# Altium schematic sheet Programador XILINX.SCHDOC
size 276 x 175 mm; SheetNumber: 0; SheetTotal: 0; REV 1: AAAAAAAAAAAAAAAA AAAAAAAAAAAAAAA AAAAAAAAAAAAAAAAAA AAAAAAAAAAAAAAAAAAA AAAAAAAAAAAAAAAAAAAAA AAAAAAAAAAAAAAAAAAAAA AAAAAAAAAAAAAAAAAAAAAA AAAAAAAAAAAAA
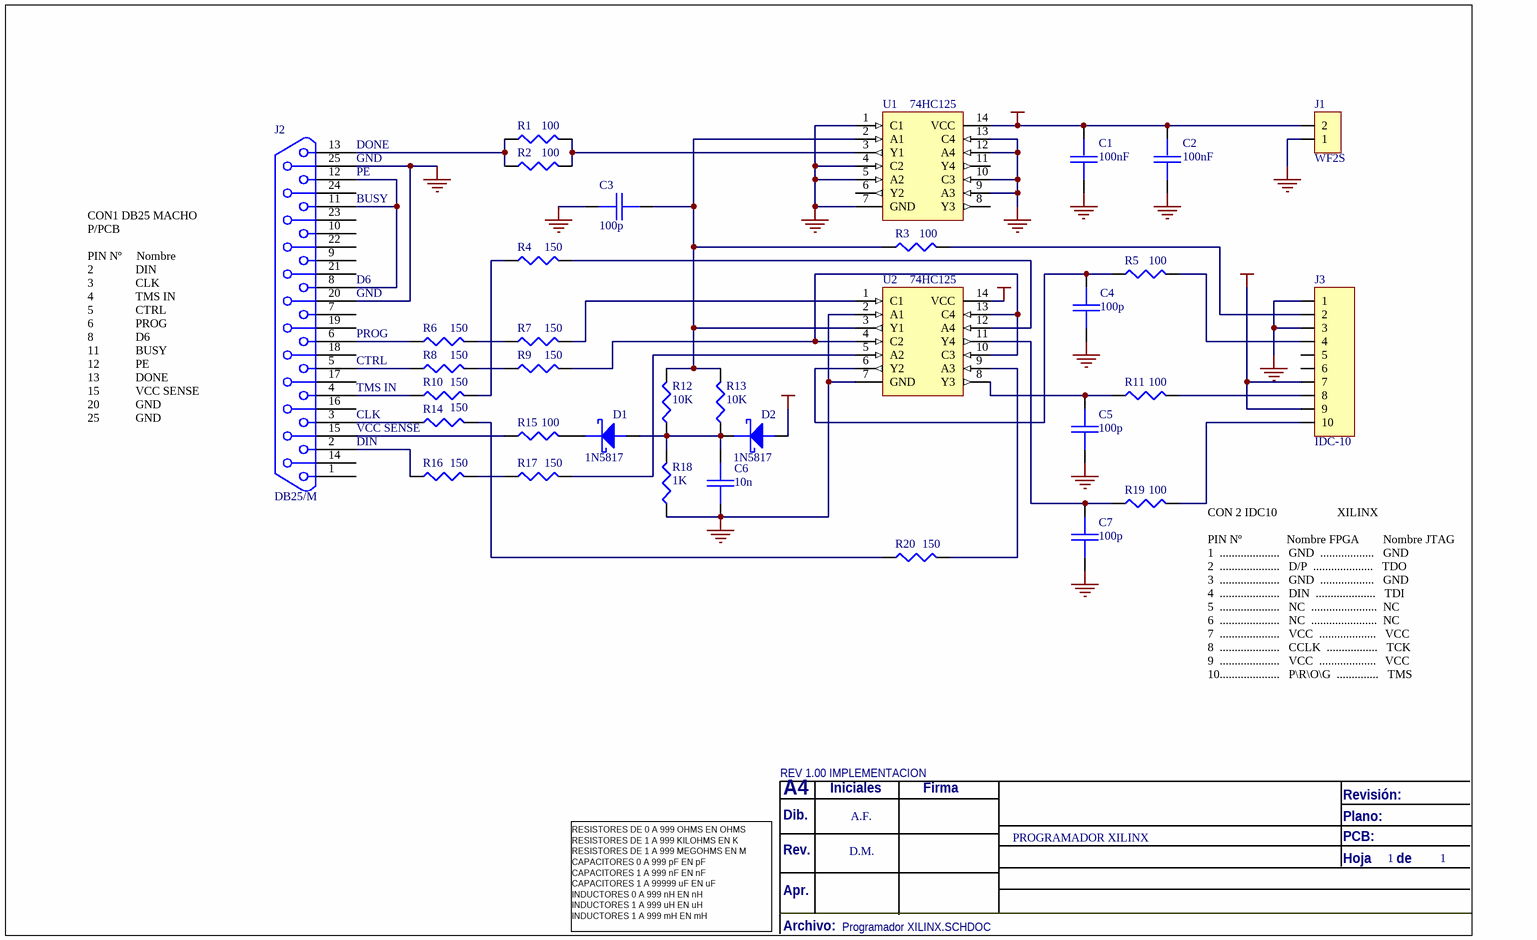
[diagram p0: Programador XILINX.SCHDOC]

## Parts
C1  100nF  [0805]
C2  100nF  [0805]
C3  100p  [CAP2.54]
C4  100p  [CAP2.54]
C5  100p  [CAP2.54]
C6  10n  [CAP2.54]
C7  100p  [CAP2.54]
D1  1N5817  [DO-41_300]
D2  1N5817  [DO-41_300]
J1  WF2S  [WF2S]
J2  DB25/M  [DB25 MACHO 90º]
J3  IDC-10  [IDC10]
R1  100  [RES_MF1/2W_200]
R2  100  [RES_MF1/2W_200]
R3  100  [RES_MF1/2W_200]
R4  150  [RES_MF1/2W_200]
R5  100  [RES_MF1/2W_200]
R6  150  [RES_MF1/2W_200]
R7  150  [RES_MF1/2W_200]
R8  150  [RES_MF1/2W_200]
R9  150  [RES_MF1/2W_200]
R10  150  [RES_MF1/2W_200]
R11  100  [RES_MF1/2W_200]
R12  10K  [RES_MF1/2W_300]
R13  10K  [RES_MF1/2W_200]
R14  150  [RES_MF1/2W_200]
R15  100  [RES_MF1/2W_200]
R16  150  [RES_MF1/2W_200]
R17  150  [RES_MF1/2W_200]
R18  1K  [RES_MF1/2W_300]
R19  100  [RES_MF1/2W_200]
R20  150  [RES_MF1/2W_200]
U1  74HC125  [DIP14]
U2  74HC125  [DIP14]

## Nets
GND: C1.2 C2.2 C3.1 C4.1 C5.1 C6.1 C7.1 J1.1 J2.20 J2.25 J3.1 J3.3 R18.1 U1.1(C1) U1.4(C2) U1.5(A2) U1.7(GND) U1.9(A3) U1.10(C3) U1.12(A4) U1.13(C4) U2.2(A1) U2.7(GND)
VCC: C1.1 C2.1 D2.A J1.2 J3.7 J3.9 U1.14(VCC) U2.14(VCC)
NetC3_2: C3.2 R3.1 R12.2 R13.2 U1.2(A1) U2.3(Y1)
NetC4_2: C4.2 R5.1 U2.6(Y2)
NetC5_2: C5.2 R11.1 U2.8(Y3)
NetC6_2: C6.2 D1.A D2.K R12.1 R13.1 R18.2
NetC7_2: C7.2 R19.1 U2.11(Y4)
NetD1_K: D1.K R15.2
NetJ2_2: J2.2 R16.1
NetJ2_3: J2.3 R14.1
NetJ2_4: J2.4 R10.1
NetJ2_5: J2.5 R8.1
NetJ2_6: J2.6 R6.1
NetJ2_8: J2.8 J2.11 J2.12
NetJ2_13: J2.13 R1.1 R2.1
NetJ2_15: J2.15 R15.1
NetJ3_2: J3.2 R3.2
NetJ3_4: J3.4 R5.2
NetJ3_8: J3.8 R11.2
NetJ3_10: J3.10 R19.2
NetR1_2: R1.2 R2.2 U1.3(Y1)
NetR4_1: R4.1 R10.2
NetR4_2: R4.2 U2.12(A4)
NetR6_2: R6.2 R7.1
NetR7_2: R7.2 U2.1(C1)
NetR8_2: R8.2 R9.1
NetR9_2: R9.2 U2.4(C2) U2.10(C3) U2.13(C4)
NetR14_2: R14.2 R20.1
NetR16_2: R16.2 R17.1
NetR17_2: R17.2 U2.5(A2)
NetR20_2: R20.2 U2.9(A3)

Not connected (* = marked no-connect by the designer): J2 1 7 9 10 14 16 17 18 19 21 22 23 24; J3 ?1(5) ?2(6); U1 6(Y2) 8(Y3) 11(Y4)

## Notes on the sheet
- (near J2) DONE
- (near J2) BUSY
- (near J2) GND
- (near J2) PE
- (near J2) D6
- GND
- PROG
- CLK
- CTRL
- TMS IN
- (near J2) CON1 DB25 MACHO
  P/PCB
  PIN Nº     Nombre
  2              DIN
  3              CLK
  4              TMS IN
  5              CTRL
  6              PROG
  8              D6
  11            BUSY
  12            PE
  13            DONE
  15            VCC SENSE
  20            GND
  25            GND
- (near R14) VCC SENSE
- DIN
- (near R19) CON 2 IDC10                    XILINX
  PIN Nº               Nombre FPGA        Nombre JTAG
  1  ....................   GND  ..................   GND
  2  ....................   D/P  ....................   TDO
  3  ....................   GND  ..................   GND
  4  ....................   DIN  ....................   TDI
  5  ....................   NC  ......................  NC
  6  ....................   NC  ......................  NC
  7  ....................   VCC  ...................   VCC
  8  ....................   CCLK  .................   TCK
  9  ....................   VCC  ...................   VCC
  10....................   P\R\O\G  ..............   TMS
- A.F.
- D.M.
- PROGRAMADOR XILINX
- 1
- REV 1.00 IMPLEMENTACION
- Dib.
- A4
- Iniciales
- Firma
- Plano:
- Revisión:
- Rev.
- Apr.
- Hoja       de
- PCB:
- RESISTORES DE 0 A 999 OHMS EN OHMS
  RESISTORES DE 1 A 999 KILOHMS EN K
  RESISTORES DE 1 A 999 MEGOHMS EN M
  CAPACITORES 0 A 999 pF EN pF
  CAPACITORES 1 A 999 nF EN nF
  CAPACITORES 1 A 99999 uF EN uF
  INDUCTORES 0 A 999 nH EN nH
  INDUCTORES 1 A 999 uH EN uH
  INDUCTORES 1 A 999 mH EN mH
- Archivo:

## Library data of the parts
C1 C2 = 100n: CAPACITOR SMD 0805 X7R  50 V 100 nF; CODIGO: YSBC104AAG
C3-C5 C7 = 100p: CAPACITOR CERAMICO DISCO 2.54 mm  X7R  50V  100pF; CODIGO: YCAC101AAG
C6 = 10n: CAPACITOR CERAMICO DISCO 2.54 mm  X7R  50V  10nF; CODIGO: YCAC103AAG
D1 D2 = 1N5817 DO-41: DIODO SCHOTTKY 1N5817 DO-41; CODIGO: DSN5817ACG
J1 = WF2S: WF2S HEADER .100" RECTO 2 VIAS; CODIGO: JCXGASP02G
J2 = DB25/M: DB25M CONECTOR D SUBMINIATURA 12 VIAS MACHO CABLE; CODIGO: JNXIASC25G
J3 = IDC10: CONECTOR IDC MACHO PCB NO POLARIZADO PASO 2.54 mm RECTO 2X5 VIAS; CODIGO: JCXJCSP10G
R1-R3 R5 R11 R15 R19 = 100: RESISTOR METAL FILM 0.5 W 5% 100 OHMS; CODIGO: RMC00101EG
R4 R6-R10 R14 R16 R17 R20 = 150: RESISTOR METAL FILM 0.5 W 5% 150 OHMS; CODIGO: RMC00151EG
R12 R13 = 10K: RESISTOR METAL FILM 0.5 W 5% 10 KILOHMS; CODIGO: RMC00103EG
R18 = 1K: RESISTOR METAL FILM 0.5 W 5% 1 K OHMS; CODIGO: RMC00102EG
U1 U2 = 74HC125 DIP: QUAD 3-STATE NON INVERTING BUFFERS; CODIGO: UDHC125AFG